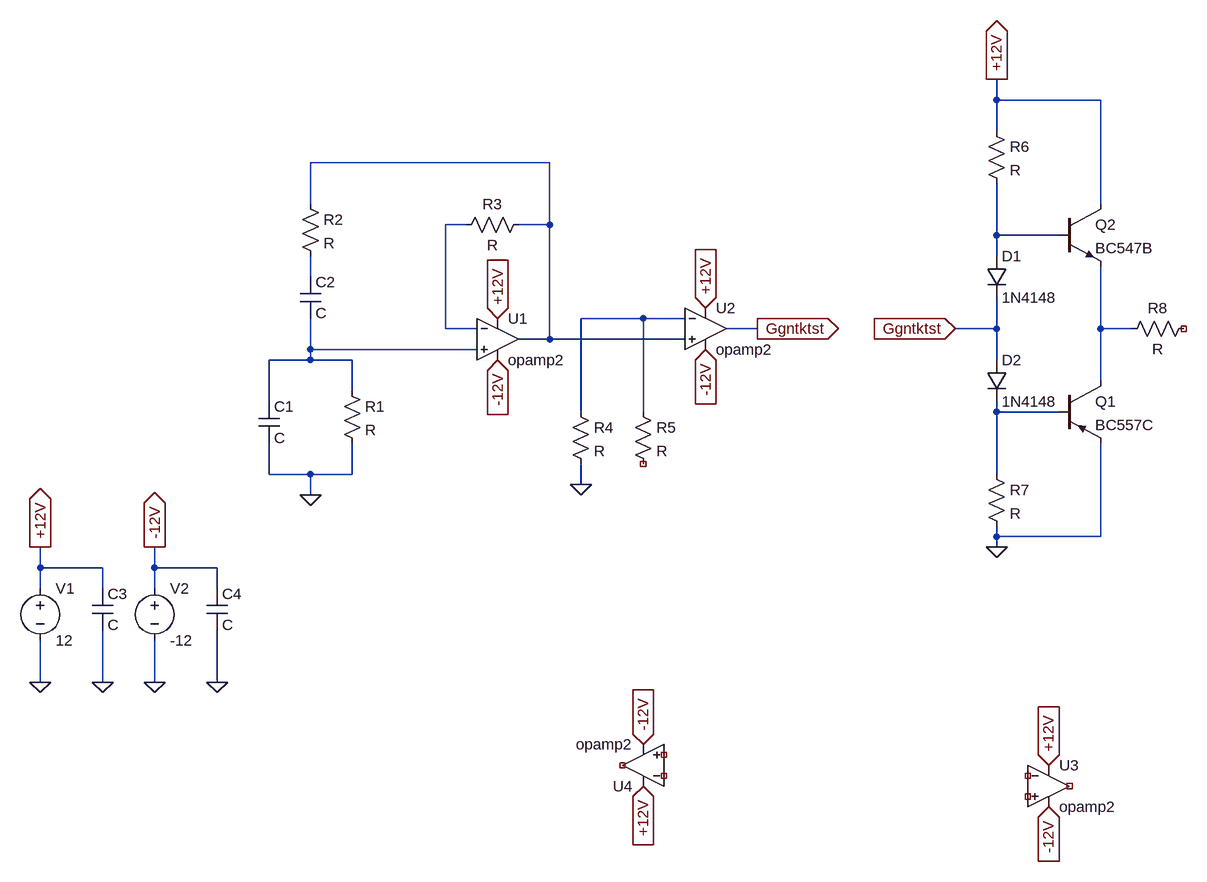
[diagram p0: schematic Schematic.asc]
Schematic.asc, the LTspice schematic file:
Version 4
SHEET 1 1432 884
WIRE 1136 -320 1136 -352
WIRE 1296 -320 1136 -320
WIRE 1136 -272 1136 -320
WIRE 448 -224 80 -224
WIRE 80 -160 80 -224
WIRE 1296 -160 1296 -320
WIRE 320 -128 288 -128
WIRE 448 -128 448 -224
WIRE 448 -128 400 -128
WIRE 1136 -112 1136 -192
WIRE 1232 -112 1136 -112
WIRE 1136 -80 1136 -112
WIRE 80 -48 80 -80
WIRE 592 16 496 16
WIRE 656 16 592 16
WIRE 288 32 288 -128
WIRE 336 32 288 32
WIRE 768 32 720 32
WIRE 1136 32 1136 -16
WIRE 1136 32 1072 32
WIRE 1296 32 1296 -64
WIRE 1344 32 1296 32
WIRE 448 48 448 -128
WIRE 448 48 400 48
WIRE 656 48 448 48
WIRE 80 64 80 16
WIRE 336 64 80 64
WIRE 80 80 80 64
WIRE 80 80 16 80
WIRE 144 80 80 80
WIRE 1136 80 1136 32
WIRE 1296 112 1296 32
WIRE 144 128 144 80
WIRE 16 144 16 80
WIRE 496 160 496 16
WIRE 592 160 592 16
WIRE 1136 160 1136 144
WIRE 1232 160 1136 160
WIRE 16 256 16 208
WIRE 80 256 16 256
WIRE 144 256 144 208
WIRE 144 256 80 256
WIRE 1136 256 1136 160
WIRE 496 272 496 240
WIRE 80 288 80 256
WIRE 1136 352 1136 336
WIRE 1296 352 1296 208
WIRE 1296 352 1136 352
WIRE 1136 368 1136 352
WIRE -336 400 -336 368
WIRE -240 400 -336 400
WIRE -160 400 -160 368
WIRE -64 400 -160 400
WIRE -336 432 -336 400
WIRE -240 432 -240 400
WIRE -160 432 -160 400
WIRE -64 432 -64 400
WIRE -336 576 -336 512
WIRE -240 576 -240 496
WIRE -160 576 -160 512
WIRE -64 576 -64 496
FLAG 80 288 0
FLAG -336 576 0
FLAG -240 576 0
FLAG -160 576 0
FLAG -64 576 0
FLAG -336 368 +12V
IOPIN -336 368 Out
FLAG -160 368 -12V
IOPIN -160 368 Out
FLAG 368 16 +12V
IOPIN 368 16 In
FLAG 688 0 +12V
IOPIN 688 0 In
FLAG 592 736 +12V
IOPIN 592 736 In
FLAG 1216 704 +12V
IOPIN 1216 704 In
FLAG 368 80 -12V
IOPIN 368 80 In
FLAG 688 64 -12V
IOPIN 688 64 In
FLAG 592 672 -12V
IOPIN 592 672 In
FLAG 1216 768 -12V
IOPIN 1216 768 In
FLAG 496 272 0
FLAG 1136 368 0
FLAG 1136 -352 +12V
IOPIN 1136 -352 Out
FLAG 1072 32 Ggntktst
IOPIN 1072 32 In
FLAG 768 32 Ggntktst
IOPIN 768 32 Out
SYMBOL cap 0 144 R0
SYMATTR InstName C1
SYMBOL cap 64 -48 R0
SYMATTR InstName C2
SYMBOL res 128 112 R0
SYMATTR InstName R1
SYMBOL res 64 -176 R0
SYMATTR InstName R2
SYMBOL OpAmps\\opamp2 368 -16 R0
SYMATTR InstName U1
SYMBOL OpAmps\\opamp2 688 -32 R0
SYMATTR InstName U2
SYMBOL OpAmps\\opamp2 1216 672 R0
SYMATTR InstName U3
SYMBOL OpAmps\\opamp2 592 768 R180
SYMATTR InstName U4
SYMBOL voltage -336 416 R0
WINDOW 123 0 0 Left 0
WINDOW 39 0 0 Left 0
SYMATTR InstName V1
SYMATTR Value 12
SYMBOL voltage -160 416 R0
WINDOW 123 0 0 Left 0
WINDOW 39 0 0 Left 0
SYMATTR InstName V2
SYMATTR Value -12
SYMBOL cap -256 432 R0
SYMATTR InstName C3
SYMBOL cap -80 432 R0
SYMATTR InstName C4
SYMBOL res 416 -144 R90
WINDOW 0 0 56 VBottom 2
WINDOW 3 32 56 VTop 2
SYMATTR InstName R3
SYMBOL res 480 144 R0
SYMATTR InstName R4
SYMBOL res 576 144 R0
SYMATTR InstName R5
SYMBOL pnp 1232 112 R0
SYMATTR InstName Q1
SYMATTR Value BC557C
SYMBOL npn 1232 -160 R0
SYMATTR InstName Q2
SYMATTR Value BC547B
SYMBOL diode 1120 -80 R0
SYMATTR InstName D1
SYMATTR Value 1N4148
SYMBOL diode 1120 80 R0
SYMATTR InstName D2
SYMATTR Value 1N4148
SYMBOL res 1120 -288 R0
SYMATTR InstName R6
SYMBOL res 1120 240 R0
SYMATTR InstName R7
SYMBOL res 1440 16 R90
WINDOW 0 0 56 VBottom 2
WINDOW 3 32 56 VTop 2
SYMATTR InstName R8

The netlist it stands for:
* Schematic.asc
C1 N007 0 C
C2 N004 N007 C
R1 N007 0 R
R2 N001 N004 R
XU1 N007 N002 +12V -12V N001 opamp2  ; pins In+ In- V+ V- OUT
XU2 N001 N005 +12V -12V Ggntktst opamp2  ; pins In+ In- V+ V- OUT
XU3 NC_01 NC_02 +12V -12V NC_03 opamp2  ; pins In+ In- V+ V- OUT
XU4 NC_04 NC_05 +12V -12V NC_06 opamp2  ; pins In+ In- V+ V- OUT
V1 +12V 0 12
V2 -12V 0 -12
C3 +12V 0 C
C4 -12V 0 C
R3 N001 N002 R
R4 N005 0 R
R5 N005 NC_07 R
Q1 N006 N008 0 0 BC557C
Q2 +12V N003 N006 0 BC547B
D1 N003 Ggntktst 1N4148
D2 Ggntktst N008 1N4148
R6 +12V N003 R
R7 N008 0 R
R8 NC_08 N006 R
.model D D
.lib standard.dio
.model NPN NPN
.model PNP PNP
.lib standard.bjt
.backanno
.end